# Altium project hv_io.PrjPCB
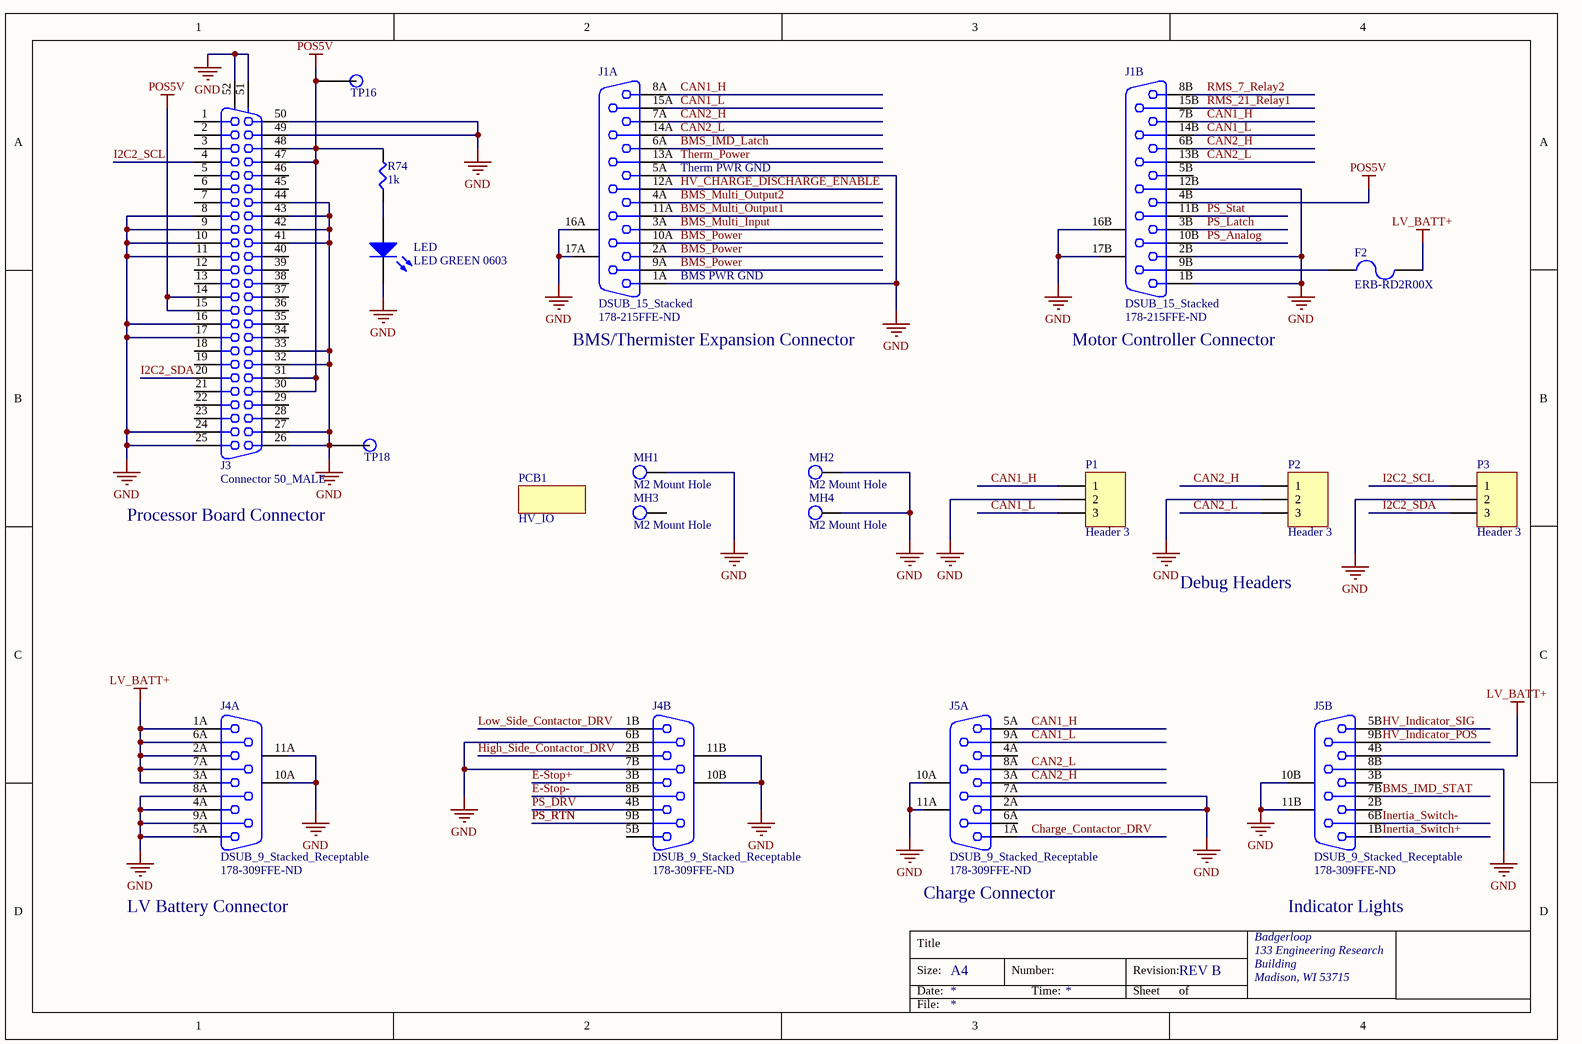
[diagram p0: hv_io_connector.SchDoc]
Revision: REV B; Part_Number: P4_EL_HV_002_HV_IO; Engineer: R. Castle; Designer: R. Castle
5 sheets, 154 parts. Net scope: global (net labels, ports and power ports of the same name join across sheets).
Board file: hv_io.PcbDoc
Sheets:
  hv_io_connector.SchDoc
  hv_io_bms.SchDoc
  hv_io_shutdown.SchDoc
  hv_io_DCDC.SchDoc
  hv_io_precharge.SchDoc

## Sheet hv_io_connector.SchDoc
size A4; Organization: Badgerloop; Address1: 133 Engineering Research; Address2: Building; Address3: Madison, WI 53715

### Parts
F2  ERB-RD2R00X  [SMD-0402-RES]
J1  DSUB_15_Stacked  Supplier Part Number 1: 178-215FFE-ND  [DSUB_15_Stacked]  (parts A,B of 2)
J3  Connector 50_MALE  [050DSUB1.27-H96 - Male]
J4  DSUB_9_Stacked_Receptable  Supplier Part Number 1: 178-309FFE-ND  [DSUB_9_Stacked]  (parts A,B of 2)
J5  DSUB_9_Stacked_Receptable  Supplier Part Number 1: 178-309FFE-ND  [DSUB_9_Stacked]  (parts A,B of 2)
LED  LED GREEN 0603  [LED 0603 GREEN]
MH1  M2 Mount Hole  [MH]
MH2  M2 Mount Hole  [MH]
MH3  M2 Mount Hole  [MH]
MH4  M2 Mount Hole  [MH]
P1  Header 3  [Pin Header 1x3 TH Pitch 2.54mm]
P2  Header 3  [Pin Header 1x3 TH Pitch 2.54mm]
P3  Header 3  [Pin Header 1x3 TH Pitch 2.54mm]
PCB1  HV_IO  [PCB]
R74  1k  [SMD-0805-RES]
TP16  TP  [Test Point]  (value not drawn)
TP18  TP  [Test Point]  (value not drawn)

### Nets
GND: J1.1A J1.1B J1.2B J1.5A J1.12B J1.16A(MH1) J1.16B(MH1) J1.17A(MH2) J1.17B(MH2) J3.8 J3.9 J3.10 J3.11 J3.16 J3.17 J3.24 J3.25 J3.26 J3.27 J3.32 J3.33 J3.41 J3.42 J3.43 J3.44 J3.49 J3.50 J3.51 J3.52 J4.4A J4.5A J4.6B J4.7B J4.8A J4.9A J4.10A(MH1) J4.10B(MH1) J4.11A(MH2) J4.11B(MH2) J5.2A J5.7A J5.8B J5.10A(MH1) J5.10B(MH1) J5.11A(MH2) J5.11B(MH2) LED.2(K) MH1.1 MH2.1 MH4.1 P1.2 P2.2 P3.2 TP18.1
LV_BATT+: F2.2 J4.1A J4.2A J4.3A J4.6A J4.7A J5.4B
POS5V: J1.4B J3.14 J3.15 J3.30 J3.31 J3.47 J3.48 R74.2 TP16.1
BMS_IMD_Latch: J1.6A
BMS_IMD_STAT: J5.7B
BMS_Multi_Input: J1.3A
BMS_Multi_Output1: J1.11A
BMS_Multi_Output2: J1.4A
BMS_Power: J1.2A J1.9A J1.10A
CAN1_H: J1.7B J1.8A J5.5A P1.1
CAN1_L: J1.14B J1.15A J5.9A P1.3
CAN2_H: J1.6B J1.7A J5.3A P2.1
CAN2_L: J1.13B J1.14A J5.8A P2.3
Charge_Contactor_DRV: J5.1A
E-Stop+: J4.3B
E-Stop-: J4.8B
High_Side_Contactor_DRV: J4.2B
HV_CHARGE_DISCHARGE_ENABLE: J1.12A
HV_Indicator_POS: J5.9B
HV_Indicator_SIG: J5.5B
I2C2_SCL: J3.4 P3.1
I2C2_SDA: J3.20 P3.3
Inertia_Switch+: J5.1B
Inertia_Switch-: J5.6B
Low_Side_Contactor_DRV: J4.1B
PS_Analog: J1.10B
PS_DRV: J4.4B
PS_Latch: J1.3B
PS_RTN: J4.9B
PS_Stat: J1.11B
RMS_7_Relay2: J1.8B
RMS_21_Relay1: J1.15B
Therm_Power: J1.13A
NetF2_1: F2.1 J1.9B
NetLED_1: LED.1(A) R74.1

Not connected (* = marked no-connect by the designer): J1 5B(5); J3 1 2 3 5 6 7 12 13 18 19 21 22 23 28 29 34 35 36 37 38 39 40 45 46; J4 5B(5); J5 2B(2) 3B(3) 4A(4) 6A(6); MH3 1

### Notes on the sheet
- (near J1) Therm PWR GND
- (near J1) BMS PWR GND
- (near J1) BMS/Thermister Expansion Connector
- (near J1) Motor Controller Connector
- Processor Board Connector
- Debug Headers
- LV Battery Connector
- (near J5) Charge Connector
- Indicator Lights
- Title
- Size:
- Date:
- A4
- Number:
- Time:
- Revision:
- Sheet
- of
- File:

### Library data of the parts
F2 = ERB-RD2R00X: FUSE BOARD MOUNT 2A 32VDC 0402; Manufacturer: Panasonic; Manufacturer P/N: ERB-RD2R00X; Digikey P/N: P15123TR-ND; Digikey Link: https://www.digikey.com/product-detail/en/panasonic-electronic-components/ERB-RD2R00X/P15123TR-ND/2796785
J1 = DSUB_15_Stacked: CONN D-SUB RCPT 15POS R/A SLDR; pin to pad: 1>16 1A>1 1B>16 2>17 2A>2 2B>17 3>18 3A>3 3B>18 4>19 4A>4 4B>19 5>20 5A>5 5B>20 6>21 6A>6 6B>21 7>22 7A>7 7B>22 8>23 8A>8 8B>23 9>24 9A>9 9B>24 10>25 10A>10 10B>25 11>26 11A>11 11B>26 12>27 12A>12 12B>27 13>28 13A>13 13B>28 14>29 14A>14 14B>29 15>30 15A>15 15B>30 16>31 16A>32 16B>34 17>32 17A>31 17B>33; Manufacturer: NorComp; Manufacturer Part Number: 178-015-513R491; Body Material: Steel; Current Rating: 5A; Connector Type: D-Sub,Receptacle,Signal; Number of Contacts: 30; Gender: Female; Supplier 1: Digi-Key; RoHS: Yes; Stock 1: 2348; Pricing 1: 1 = 8.81000, 10 = 8.42600, 35 = 7.66000, 70 = 7.27700, 105 = 7.08552, 280 = 6.31950, 525 = 5.93650, 1015 = 5.24710 (USD); Mount: Edge,Through Hole; Color: Black; Contact Plating: Gold; Contact Material: Brass; Housing Material: Nylon; Min Operating Temperature: -55°C; Max Operating Temperature: 105°C; Package Quantity: 35; Packaging: Tray; Termination: Solder; Features: Shielded; REACH SVHC: No SVHC; Lead Free: Lead Free; ComponentLink1URL: https://www.norcomp.net/rohspdfs/Connectors/17Y/178/513/178-YYY-513R491.pdf; ComponentLink1Description: https://www.norcomp.net/rohspdfs/Connectors/17Y/178/513/178-YYY-513R491.pdf; ComponentLink2URL: http://www.norcomp.net/rohspdfs/Connectors/17Y/178/513/178-YYY-513R491.pdf; ComponentLink2Description: http://www.norcomp.net/rohspdfs/Connectors/17Y/178/513/178-YYY-513R491.pdf
J3 = Connector 50_MALE: Receptacle Header Assemby; Manufacturer: HARTING; Manufacturer P/N: 09665526616; Digikey Link: https://www.digikey.com/product-detail/en/harting/09665526616/1195-2568-ND/3181151; Digikey P/N: 1195-2568-ND
J4 J5 = DSUB_9_Stacked_Receptable: CONN D-SUB RCPT 9POS R/A SLDR; pin to pad: 1>10 1A>1 1B>10 2>11 2A>2 2B>11 3>12 3A>3 3B>12 4>13 4A>4 4B>13 5>14 5A>5 5B>14 6>15 6A>6 6B>15 7>16 7A>7 7B>16 8>17 8A>8 8B>17 9>18 9A>9 9B>18 10>22 10A>20 10B>22 11>21 11A>19 11B>21; Manufacturer: NorComp; Manufacturer Part Number: 178-009-513R691; Plating: Nickel; Gender: Female to Female; Current Rating: 5A; Connector Type: D-Sub,Receptacle,Signal; Number of Contacts: 9; Number of Ports: 2; Supplier 1: Digi-Key; RoHS: Yes; Stock 1: 1545; Pricing 1: 1 = 7.32000, 10 = 7.01500, 45 = 6.40511, 90 = 6.10000, 135 = 5.79504, 270 = 5.18500, 540 = 4.88000, 1035 = 4.27000 (USD); Mount: Edge,Through Hole; Contact Material: Brass; Contact Plating: Gold; Color: Black; Shell Material: Steel; Housing Material: Nylon; Min Operating Temperature: -55°C; Max Operating Temperature: 105°C; Package Quantity: 45; Packaging: Tray; Termination: Solder; Features: Shielded; Lead Free: Lead Free; ComponentLink1URL: http://www.norcomp.net/rohspdfs/Connectors/17Y/178/513/178-YYY-513R691.pdf; ComponentLink1Description: http://www.norcomp.net/rohspdfs/Connectors/17Y/178/513/178-YYY-513R691.pdf
LED = LED GREEN 0603: Manufacturer: Lite-On Inc.; Manufacturer P/N: LTST-C190KGKT; Digikey P/N: 160-1435-1-ND; Package / Case: 0603; Color: GREEN
P1-P3 = Header 3: Header, 3-Pin; LatestRevisionDate: 17-Jul-2002; LatestRevisionNote: Re-released for DXP Platform.; Publisher: Altium Limited
PCB1 = PCB
R74 = ERJ-P06J102V: RES SMD 1K OHM 5% 1/2W 0805; Manufacturer: Panasonic Electronic Components; Factory Stock: 0; Unit Price (USD): 0.01839; @ qty: 1500; Minimum Quantity: 1; Power (Watts): 0.5W, 1/2W; Temperature Coefficient: ±200ppm/°C; Part Number: ERJ-P06J102V; Datasheets: https://industrial.panasonic.com/cdbs/www-data/pdf/RDA0000/AOA0000C243.pdf; Image: //media.digikey.com/Renders/Panasonic%20Renders/ERJ-0805%20Pkg.jpg; Digi-Key Part Number: P1.0KADCT-ND; Quantity Available: 124757; Packaging: Cut Tape (CT); Series: ERJ; Part Status: Active; Value: 1k; Tolerance: ±5%; Composition: Thick Film; Features: Automotive AEC-Q200, Pulse Withstanding; Operating Temperature: -55°C ~ 155°C; Package / Case: 0805 (2012 Metric); Supplier Device Package: 0805; Size / Dimension: 0.079" L x 0.049" W (2.00mm x 1.25mm); Height - Seated (Max): 0.028" (0.70mm); Number of Terminations: 2; Failure Rate: -; Digikey P/N: ERJ-P06J102V

## Sheet hv_io_bms.SchDoc
size A4; Organization: Badgerloop; Address1: 133 Engineering Research; Address2: Building; Address3: Madison, WI 53715
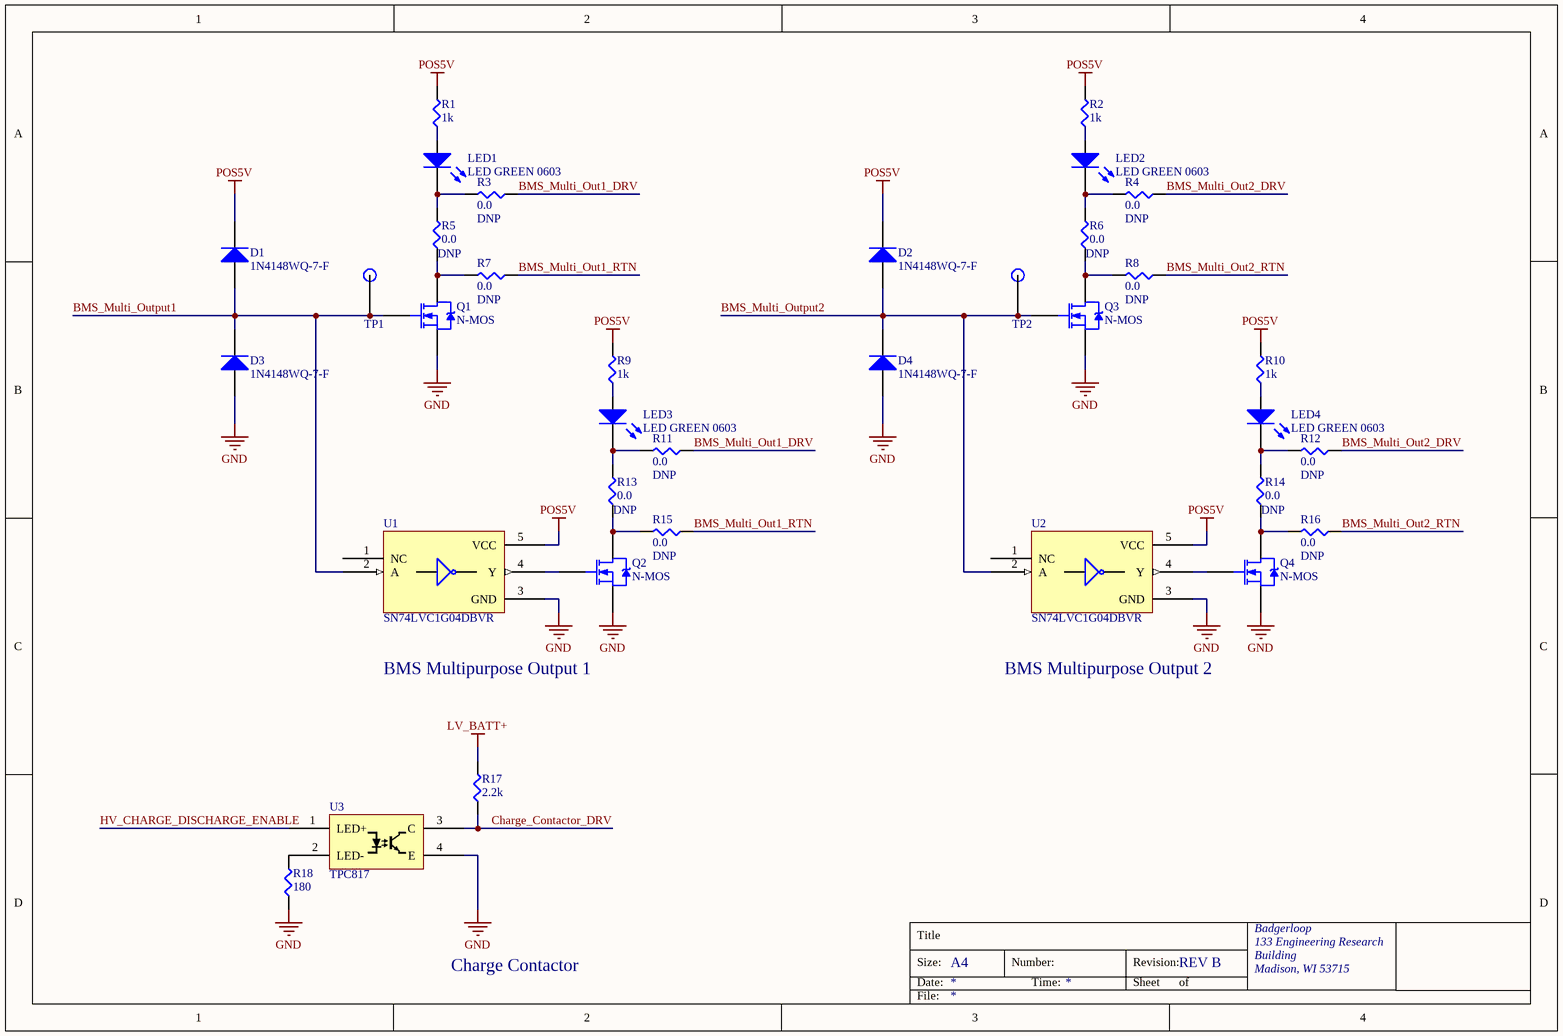
[diagram p1: hv_io_bms.SchDoc]

### Parts
D1  1N4148WQ-7-F  [SODFL370X100-2N]
D2  1N4148WQ-7-F  [SODFL370X100-2N]
D3  1N4148WQ-7-F  [SODFL370X100-2N]
D4  1N4148WQ-7-F  [SODFL370X100-2N]
LED1  LED GREEN 0603  [LED 0603 GREEN]
LED2  LED GREEN 0603  [LED 0603 GREEN]
LED3  LED GREEN 0603  [LED 0603 GREEN]
LED4  LED GREEN 0603  [LED 0603 GREEN]
Q1  N-MOS  [DPAK228P991X238-3N]
Q2  N-MOS  [DPAK228P991X238-3N]
Q3  N-MOS  [DPAK228P991X238-3N]
Q4  N-MOS  [DPAK228P991X238-3N]
R1  1k  [SMD-0402-RES]
R2  1k  [SMD-0402-RES]
R3  0.0  [SMD-0402-RES]
R4  0.0  [SMD-0402-RES]
R5  0.0  [SMD-0402-RES]
R6  0.0  [SMD-0402-RES]
R7  0.0  [SMD-0402-RES]
R8  0.0  [SMD-0402-RES]
R9  1k  [SMD-0402-RES]
R10  1k  [SMD-0402-RES]
R11  0.0  [SMD-0402-RES]
R12  0.0  [SMD-0402-RES]
R13  0.0  [SMD-0402-RES]
R14  0.0  [SMD-0402-RES]
R15  0.0  [SMD-0402-RES]
R16  0.0  [SMD-0402-RES]
R17  2.2k  [SMD-1206-RES]
R18  180  [SMD-1206-RES]
TP1  TP  [Test Point]  (value not drawn)
TP2  TP  [Test Point]  (value not drawn)
U1  SN74LVC1G04DBVR  [DBV5-L]
U2  SN74LVC1G04DBVR  [DBV5-L]
U3  TPC817  [SOT200P1005X328-5N]

### Nets
GND: D3.1(A) D4.1(A) Q1.3(S) Q2.3(S) Q3.3(S) Q4.3(S) R18.1 U1.3(GND) U2.3(GND) U3.4(E)
LV_BATT+: R17.2
POS5V: D1.2(K) D2.2(K) R1.2 R2.2 R9.2 R10.2 U1.5(VCC) U2.5(VCC)
BMS_Multi_Out1_DRV: R3.1 R11.1
BMS_Multi_Out1_RTN: R7.1 R15.1
BMS_Multi_Out2_DRV: R4.1 R12.1
BMS_Multi_Out2_RTN: R8.1 R16.1
BMS_Multi_Output1: D1.1(A) D3.2(K) Q1.1(G) TP1.1 U1.2(A)
BMS_Multi_Output2: D2.1(A) D4.2(K) Q3.1(G) TP2.1 U2.2(A)
Charge_Contactor_DRV: R17.1 U3.3(C)
HV_CHARGE_DISCHARGE_ENABLE: U3.1(LED+)
NetLED1_1: LED1.1(A) R1.1
NetLED1_2: LED1.2(K) R3.2 R5.2
NetLED2_1: LED2.1(A) R2.1
NetLED2_2: LED2.2(K) R4.2 R6.2
NetLED3_1: LED3.1(A) R9.1
NetLED3_2: LED3.2(K) R11.2 R13.2
NetLED4_1: LED4.1(A) R10.1
NetLED4_2: LED4.2(K) R12.2 R14.2
NetQ1_4: Q1.4(D) R5.1 R7.2
NetQ2_1: Q2.1(G) U1.4(Y)
NetQ2_4: Q2.4(D) R13.1 R15.2
NetQ3_4: Q3.4(D) R6.1 R8.2
NetQ4_1: Q4.1(G) U2.4(Y)
NetQ4_4: Q4.4(D) R14.1 R16.2
NetR18_2: R18.2 U3.2(LED-)

Not connected (* = marked no-connect by the designer): U1 1(NC); U2 1(NC)

### Notes on the sheet
- BMS Multipurpose Output 1
- BMS Multipurpose Output 2
- Charge Contactor
- Title
- Size:
- Date:
- A4
- Number:
- Time:
- Revision:
- Sheet
- of
- File:

### Library data of the parts
D1-D4 = 1N4148WQ-7-F: Diodes - General Purpose, Power, Switching SMT Fast Switching Diode; Manufacturer: Diodes Inc.; Digikey Link: https://www.digikey.com/product-detail/en/diodes-incorporated/1N4148WQ-7-F/1N4148WQ-7-FDITR-ND/8136126; Manufacturer P/N: 1N4148WQ-7-F; Digikey P/N: 1N4148WQ-7-FDITR-ND
LED1-LED4 = LED GREEN 0603: as LED on sheet hv_io_connector; Digikey P/N: 160-1435-1-ND; Package / Case: 0603; Color: GREEN
Q1-Q4 = N-MOS: N-Channel Power MOSFET, 12 A, 60 V; Manufacturer: ON SEMI; Manufacturer P/N: NTD3055L104T4G; Digikey Link: https://www.digikey.com/product-detail/en/on-semiconductor/NTD3055L104T4G/NTD3055L104T4GOSDKR-ND/1749196; Digikey P/N: NTD3055L104T4GOSDKR-ND
R1 R2 R9 R10 = ERJ-2GEJ102X: RES SMD 1K OHM 5% 1/10W 0402; Manufacturer: Panasonic Electronic Components; Factory Stock: 0; Unit Price (USD): 0.00350; @ qty: 1500; Minimum Quantity: 1; Power (Watts): 0.1W, 1/10W; Temperature Coefficient: ±200ppm/°C; Part Number: ERJ-2GEJ102X; Datasheets: http://industrial.panasonic.com/www-cgi/jvcr13pz.cgi?E+PZ+3+AOA0001+ERJ2GEJ102X+7+WW; Image: //media.digikey.com/Photos/Panasonic%20Photos/ERJ-PA2-Series.jpg; Digi-Key Part Number: P1.0KJCT-ND; Quantity Available: 1939857; Packaging: Cut Tape (CT); Series: ERJ; Part Status: Active; Value: 1k; Tolerance: ±5%; Composition: Thick Film; Features: Automotive AEC-Q200; Operating Temperature: -55°C ~ 155°C; Package / Case: 0402 (1005 Metric); Supplier Device Package: 0402; Size / Dimension: 0.039" L x 0.020" W (1.00mm x 0.50mm); Height - Seated (Max): 0.016" (0.40mm); Number of Terminations: 2; Failure Rate: -; Digikey P/N: ERJ-2GEJ102X
R3-R8 R11-R16 = ERJ-2GE0R00X: RES SMD 0.0OHM JUMPER 1/10W 0402; Manufacturer: Panasonic Electronic Components; Factory Stock: 0; Unit Price (USD): 0.00384; @ qty: 1500; Minimum Quantity: 1; Power (Watts): 0.1W, 1/10W; Part Number: ERJ-2GE0R00X; Datasheets: http://industrial.panasonic.com/www-cgi/jvcr13pz.cgi?E+PZ+3+AOA0001+ERJ2GE0R00X+7+WW; Image: //media.digikey.com/Photos/Panasonic%20Photos/ERJ-PA2-Series.jpg; Digi-Key Part Number: P0.0JCT-ND; Quantity Available: 3152483; Packaging: Cut Tape (CT); Series: ERJ; Part Status: Active; Value: 0.0; Tolerance: Jumper; Composition: Thick Film; Features: Automotive AEC-Q200; Temperature Coefficient: -; Operating Temperature: -55°C ~ 155°C; Package / Case: 0402 (1005 Metric); Supplier Device Package: 0402; Size / Dimension: 0.039" L x 0.020" W (1.00mm x 0.50mm); Height - Seated (Max): 0.016" (0.40mm); Number of Terminations: 2; Failure Rate: -; Digikey P/N: ERJ-2GE0R00X; DNP: DNP
R17 = ERJ-8ENF2201V: RES SMD 2.2K OHM 1% 1/4W 1206; Manufacturer: Panasonic Electronic Components; Factory Stock: 0; Unit Price (USD): 0.00933; @ qty: 1500; Minimum Quantity: 1; Power (Watts): 0.25W, 1/4W; Temperature Coefficient: ±100ppm/°C; Part Number: ERJ-8ENF2201V; Datasheets: http://industrial.panasonic.com/www-cgi/jvcr13pz.cgi?E+PZ+3+AOA0002+ERJ8ENF2201V+7+WW; Image: //media.digikey.com/Renders/Panasonic%20Renders/ERJ-1206%20Pkg.jpg; Digi-Key Part Number: P2.20KFCT-ND; Quantity Available: 220817; Packaging: Cut Tape (CT); Series: ERJ; Part Status: Active; Value: 2.2k; Tolerance: ±1%; Composition: Thick Film; Features: Automotive AEC-Q200; Operating Temperature: -55°C ~ 155°C; Package / Case: 1206 (3216 Metric); Supplier Device Package: 1206; Size / Dimension: 0.126" L x 0.063" W (3.20mm x 1.60mm); Height - Seated (Max): 0.028" (0.70mm); Number of Terminations: 2; Failure Rate: -; Digikey P/N: ERJ-8ENF2201V
R18 = ERJ-8ENF1800V: RES SMD 180 OHM 1% 1/4W 1206; Manufacturer: Panasonic Electronic Components; Factory Stock: 0; Unit Price (USD): 0.00933; @ qty: 1500; Minimum Quantity: 1; Power (Watts): 0.25W, 1/4W; Temperature Coefficient: ±100ppm/°C; Part Number: ERJ-8ENF1800V; Datasheets: http://industrial.panasonic.com/www-cgi/jvcr13pz.cgi?E+PZ+3+AOA0002+ERJ8ENF1800V+7+WW; Image: //media.digikey.com/Renders/Panasonic%20Renders/ERJ-1206%20Pkg.jpg; Digi-Key Part Number: P180FCT-ND; Quantity Available: 4031; Packaging: Cut Tape (CT); Series: ERJ; Part Status: Active; Value: 180; Tolerance: ±1%; Composition: Thick Film; Features: Automotive AEC-Q200; Operating Temperature: -55°C ~ 155°C; Package / Case: 1206 (3216 Metric); Supplier Device Package: 1206; Size / Dimension: 0.126" L x 0.063" W (3.20mm x 1.60mm); Height - Seated (Max): 0.028" (0.70mm); Number of Terminations: 2; Failure Rate: -
U1 U2 = SN74LVC1G04DBVR: Manufacturer: TI; Digikey Link: https://www.digikey.com/product-detail/en/texas-instruments/SN74LVC1G04DBVR/296-11599-1-ND/385738; Manufacturer P/N: SN74LVC1G04DBVR; Digikey P/N: 296-11599-1-ND
U3 = TPC817: OPTOISO 5KV TRANS 4SOP; Manufacturer: Taiwan Semi; Manufacturer P/N: TPC817S1B RAG; Digikey Link: https://www.digikey.com/product-detail/en/taiwan-semiconductor-corporation/TPC817S1B-RAG/TPC817S1BRAGCT-ND/7359679; Digikey P/N: TPC817S1BRAGCT-ND

## Sheet hv_io_shutdown.SchDoc
size A4; Organization: Badgerloop; Address1: 133 Engineering Research; Address2: Building; Address3: Madison, WI 53715
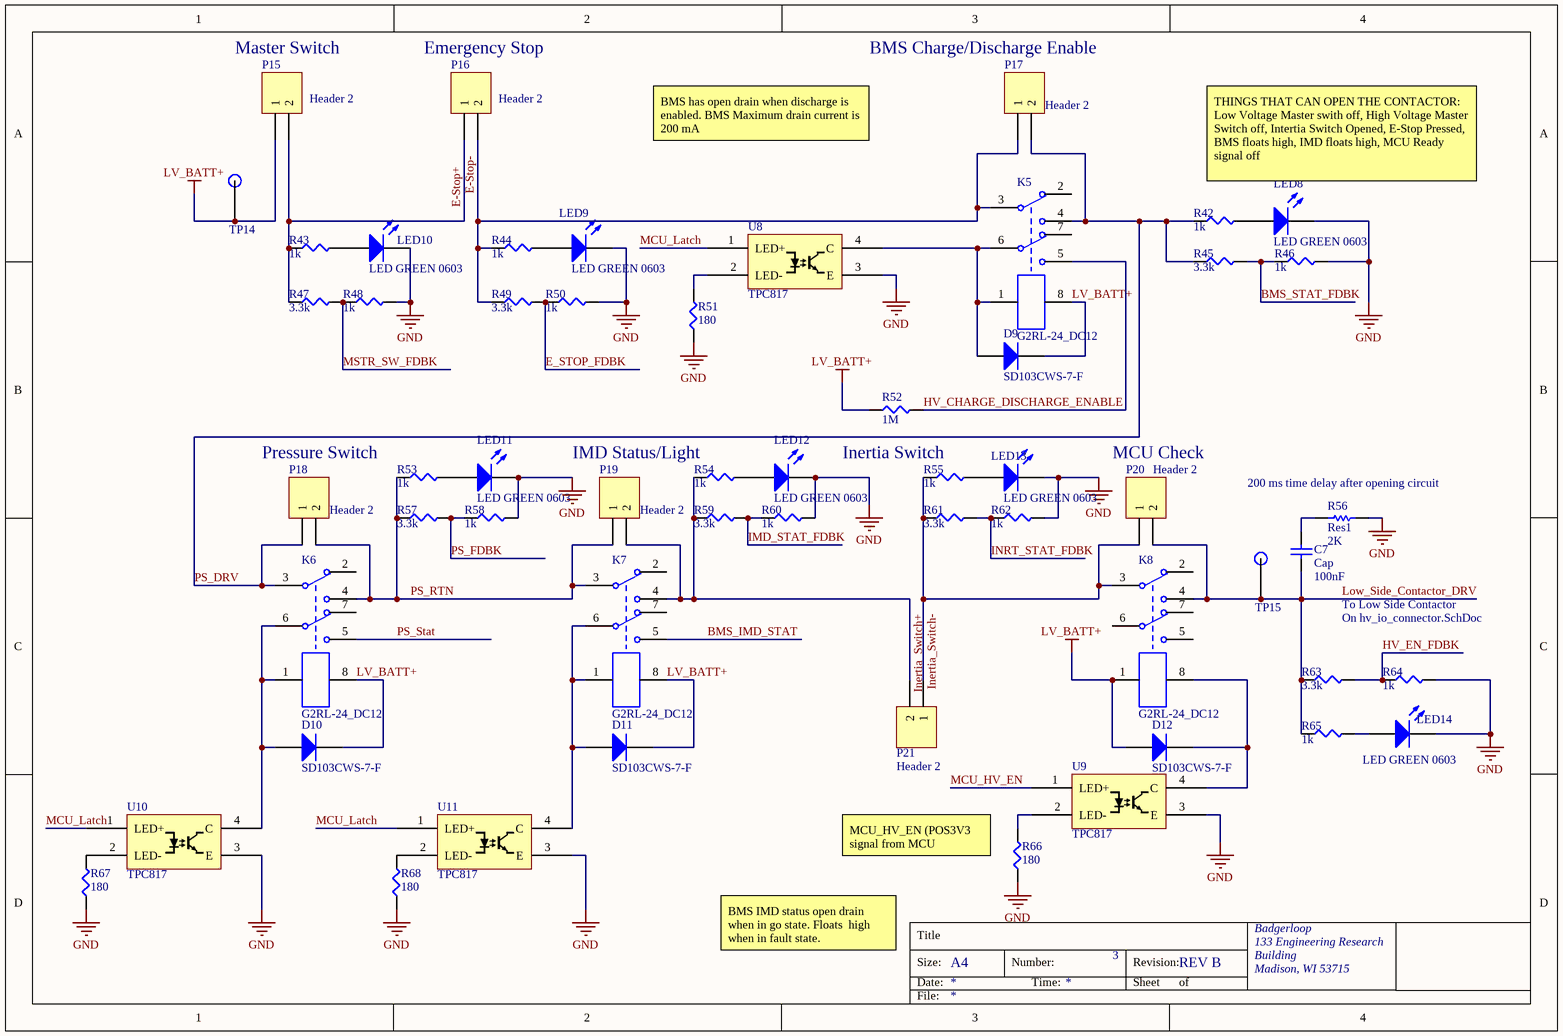
[diagram p2: hv_io_shutdown.SchDoc]

### Parts
C7  Cap  value 100nF  [SMD-1206C]
D9  SD103CWS-7-F  [SODFL250X110-2N]
D10  SD103CWS-7-F  [SODFL250X110-2N]
D11  SD103CWS-7-F  [SODFL250X110-2N]
D12  SD103CWS-7-F  [SODFL250X110-2N]
K5  G2RL-24_DC12  [G2RL]
K6  G2RL-24_DC12  [G2RL]
K7  G2RL-24_DC12  [G2RL]
K8  G2RL-24_DC12  [G2RL]
LED8  LED GREEN 0603  [LED 0603 GREEN]
LED9  LED GREEN 0603  [LED 0603 GREEN]
LED10  LED GREEN 0603  [LED 0603 GREEN]
LED11  LED GREEN 0603  [LED 0603 GREEN]
LED12  LED GREEN 0603  [LED 0603 GREEN]
LED13  LED GREEN 0603  [LED 0603 GREEN]
LED14  LED GREEN 0603  [LED 0603 GREEN]
P15  Header 2  [Pin Header 1x2 TH Pitch 2.54mm]
P16  Header 2  [Pin Header 1x2 TH Pitch 2.54mm]
P17  Header 2  [Pin Header 1x2 TH Pitch 2.54mm]
P18  Header 2  [Pin Header 1x2 TH Pitch 2.54mm]
P19  Header 2  [Pin Header 1x2 TH Pitch 2.54mm]
P20  Header 2  [Pin Header 1x2 TH Pitch 2.54mm]
P21  Header 2  [Pin Header 1x2 TH Pitch 2.54mm]
R42  1k  [SMD-0402-RES]
R43  1k  [SMD-0402-RES]
R44  1k  [SMD-0402-RES]
R45  3.3k  [SMD-0402-RES]
R46  1k  [SMD-0402-RES]
R47  3.3k  [SMD-0402-RES]
R48  1k  [SMD-0402-RES]
R49  3.3k  [SMD-0402-RES]
R50  1k  [SMD-0402-RES]
R51  180  [SMD-1206-RES]
R52  1M  [SMD-0805-RES]
R53  1k  [SMD-0402-RES]
R54  1k  [SMD-0402-RES]
R55  1k  [SMD-0402-RES]
R56  Res1  value 2K  [SMD-1206-RES]
R57  3.3k  [SMD-0402-RES]
R58  1k  [SMD-0402-RES]
R59  3.3k  [SMD-0402-RES]
R60  1k  [SMD-0402-RES]
R61  3.3k  [SMD-0402-RES]
R62  1k  [SMD-0402-RES]
R63  3.3k  [SMD-0402-RES]
R64  1k  [SMD-0402-RES]
R65  1k  [SMD-0402-RES]
R66  180  [SMD-1206-RES]
R67  180  [SMD-1206-RES]
R68  180  [SMD-1206-RES]
TP14  TP  [Test Point]  (value not drawn)
TP15  TP  [Test Point]  (value not drawn)
U8  TPC817  [SOT200P1005X328-5N]
U9  TPC817  [SOT200P1005X328-5N]
U10  TPC817  [SOT200P1005X328-5N]
U11  TPC817  [SOT200P1005X328-5N]

### Nets
GND: LED8.2(K) LED9.2(K) LED10.2(K) LED11.2(K) LED12.2(K) LED13.2(K) LED14.2(K) R46.2 R48.2 R50.2 R51.1 R56.2 R58.2 R60.2 R62.2 R64.2 R66.1 R67.1 R68.1 U8.3(E) U9.3(E) U10.3(E) U11.3(E)
LV_BATT+: D9.2(K) D10.2(K) D11.2(K) D12.1(A) K5.8 K6.8 K7.8 K8.1 P15.1 R52.1 TP14.1
BMS_IMD_STAT: K7.5
BMS_STAT_FDBK: R45.2 R46.1
E-Stop+: P15.2 P16.1 R43.1 R47.1
E-Stop-: K5.3 P16.2 P17.1 R44.1 R49.1
E_STOP_FDBK: R49.2 R50.1
HV_CHARGE_DISCHARGE_ENABLE: K5.5 R52.2
HV_EN_FDBK: R63.2 R64.1
IMD_STAT_FDBK: R59.2 R60.1
Inertia_Switch+: K7.4 P19.2 P21.2 R54.1 R59.1
Inertia_Switch-: K8.3 P20.1 P21.1 R55.1 R61.1
INRT_STAT_FDBK: R61.2 R62.1
Low_Side_Contactor_DRV: C7.1 K8.4 P20.2 R63.1 R65.1 TP15.1
MCU_HV_EN: U9.1(LED+)
MCU_Latch: U8.1(LED+) U10.1(LED+) U11.1(LED+)
MSTR_SW_FDBK: R47.2 R48.1
PS_DRV: K5.4 K6.3 P17.2 P18.1 R42.1 R45.1
PS_FDBK: R57.2 R58.1
PS_RTN: K6.4 K7.3 P18.2 P19.1 R53.1 R57.1
PS_Stat: K6.5
NetC7_2: C7.2 R56.1
NetD9_1: D9.1(A) K5.1 K5.6 U8.4(C)
NetD10_1: D10.1(A) K6.1 K6.6 U10.4(C)
NetD11_1: D11.1(A) K7.1 K7.6 U11.4(C)
NetD12_2: D12.2(K) K8.8 U9.4(C)
NetLED8_1: LED8.1(A) R42.2
NetLED9_1: LED9.1(A) R44.2
NetLED10_1: LED10.1(A) R43.2
NetLED11_1: LED11.1(A) R53.2
NetLED12_1: LED12.1(A) R54.2
NetLED13_1: LED13.1(A) R55.2
NetLED14_1: LED14.1(A) R65.2
NetR51_2: R51.2 U8.2(LED-)
NetR66_2: R66.2 U9.2(LED-)
NetR67_2: R67.2 U10.2(LED-)
NetR68_2: R68.2 U11.2(LED-)

Not connected (* = marked no-connect by the designer): K5 2 7; K6 2 7; K7 2 7; K8 2 5 6 7

### Notes on the sheet
- Master Switch
- Emergency Stop
- BMS Charge/Discharge Enable
- BMS has open drain when discharge is enabled. BMS Maximum drain current is 200 mA
- THINGS THAT CAN OPEN THE CONTACTOR: Low Voltage Master swith off, High Voltage Master Switch off, Intertia Switch Opened, E-Stop Pressed,  BMS floats high, IMD floats high, MCU Ready signal off
- (near R53) Pressure Switch
- (near R54) IMD Status/Light
- (near R55) Inertia Switch
- MCU Check
- (near R56) 200 ms time delay after opening circuit
- To Low Side Contactor
- On hv_io_connector.SchDoc
- (near R66) MCU_HV_EN (POS3V3 signal from MCU
- BMS IMD status open drain when in go state. Floats  high when in fault state.
- 3
- Title
- Size:
- Date:
- A4
- Number:
- Time:
- Revision:
- Sheet
- of
- File:

### Library data of the parts
C7 = Cap: Capacitor; Published: 8-Jun-2000; LatestRevisionDate: 17-Jul-2002; LatestRevisionNote: Re-released for DXP Platform.; PackageReference: RAD-0.3; Publisher: Altium Limited; PackageDescription: Radial Cap, Thru-Hole; 2 Leads; 0.3 in Pin Spacing
D9-D12 = Diode General Purpose_2: DIODE GEN PURP 20V 350MA SOD323; Manufacturer: Diodes Incorporated; Manufacturer P/N: SD103CWS-7-F; Digikey P/N: SD103CWS-FDIDKR-ND; Package / Case: SOD323; Do Not Populate: *; ComponentLink1Description: Digikey; ComponentLink1URL: https://www.digikey.com/product-detail/en/diodes-incorporated/SD103CWS-7-F/SD103CWS-FDIDKR-ND/1836772; ComponentLink2Description: Datasheet; ComponentLink2URL: https://www.diodes.com/assets/Datasheets/ds30101.pdf; ComponentLink3Description: Dimensions; ComponentLink3URL: https://www.diodes.com/assets/Package-Files/SOD323.pdf
K5-K8 = G2RL-24_DC12: RELAY GEN PURPOSE DPDT 8A 12V; Manufacturer: Omron Electronics; Manufacturer P/N: G2RL-24 DC12; Digikey Link: https://www.digikey.com/product-detail/en/omron-electronics-inc-emc-div/G2RL-24-DC12/Z147-ND/307667; Digikey P/N: Z147-ND
LED8-LED14 = LED GREEN 0603: as LED on sheet hv_io_connector; Digikey P/N: 160-1435-1-ND; Package / Case: 0603; Color: GREEN
P15-P21 = Header 2: Header, 2-Pin; LatestRevisionDate: 17-Jul-2002; LatestRevisionNote: Re-released for DXP Platform.; Publisher: Altium Limited
R42-R44 R46 R48 R50 R53-R55 R58 R60 R62 R64 R65 = ERJ-2GEJ102X: as R1 on sheet hv_io_bms; Part Number: ERJ-2GEJ102X; Datasheets: http://industrial.panasonic.com/www-cgi/jvcr13pz.cgi?E+PZ+3+AOA0001+ERJ2GEJ102X+7+WW; Image: //media.digikey.com/Photos/Panasonic%20Photos/ERJ-PA2-Series.jpg; Digi-Key Part Number: P1.0KJCT-ND; Quantity Available: 1939857; Packaging: Cut Tape (CT); Series: ERJ; Part Status: Active; Value: 1k; Tolerance: ±5%; Composition: Thick Film; Features: Automotive AEC-Q200; Operating Temperature: -55°C ~ 155°C; Package / Case: 0402 (1005 Metric); Supplier Device Package: 0402; Size / Dimension: 0.039" L x 0.020" W (1.00mm x 0.50mm); Height - Seated (Max): 0.016" (0.40mm); Number of Terminations: 2; Failure Rate: -; Digikey P/N: ERJ-2GEJ102X
R45 R47 R49 R57 R59 R61 R63 = ERJ-2GEJ332X: RES SMD 3.3K OHM 5% 1/10W 0402; Manufacturer: Panasonic Electronic Components; Factory Stock: 0; Unit Price (USD): 0.00350; @ qty: 1500; Minimum Quantity: 1; Power (Watts): 0.1W, 1/10W; Temperature Coefficient: ±200ppm/°C; Part Number: ERJ-2GEJ332X; Datasheets: http://industrial.panasonic.com/www-cgi/jvcr13pz.cgi?E+PZ+3+AOA0001+ERJ2GEJ332X+7+WW; Image: //media.digikey.com/Photos/Panasonic%20Photos/ERJ-PA2-Series.jpg; Digi-Key Part Number: P3.3KJCT-ND; Quantity Available: 514266; Packaging: Cut Tape (CT); Series: ERJ; Part Status: Active; Value: 3.3k; Tolerance: ±5%; Composition: Thick Film; Features: Automotive AEC-Q200; Operating Temperature: -55°C ~ 155°C; Package / Case: 0402 (1005 Metric); Supplier Device Package: 0402; Size / Dimension: 0.039" L x 0.020" W (1.00mm x 0.50mm); Height - Seated (Max): 0.016" (0.40mm); Number of Terminations: 2; Failure Rate: -; Digikey P/N: ERJ-2GEJ332X
R51 R66-R68 = ERJ-8ENF1800V: as R18 on sheet hv_io_bms; Part Number: ERJ-8ENF1800V; Datasheets: http://industrial.panasonic.com/www-cgi/jvcr13pz.cgi?E+PZ+3+AOA0002+ERJ8ENF1800V+7+WW; Image: //media.digikey.com/Renders/Panasonic%20Renders/ERJ-1206%20Pkg.jpg; Digi-Key Part Number: P180FCT-ND; Quantity Available: 4031; Packaging: Cut Tape (CT); Series: ERJ; Part Status: Active; Value: 180; Tolerance: ±1%; Composition: Thick Film; Features: Automotive AEC-Q200; Operating Temperature: -55°C ~ 155°C; Package / Case: 1206 (3216 Metric); Supplier Device Package: 1206; Size / Dimension: 0.126" L x 0.063" W (3.20mm x 1.60mm); Height - Seated (Max): 0.028" (0.70mm); Number of Terminations: 2; Failure Rate: -
R52 = ERJ-P06J105V: RES SMD 1M OHM 5% 1/2W 0805; Manufacturer: Panasonic Electronic Components; Factory Stock: 0; Unit Price (USD): 0.01839; @ qty: 1500; Minimum Quantity: 1; Power (Watts): 0.5W, 1/2W; Temperature Coefficient: ±200ppm/°C; Part Number: ERJ-P06J105V; Datasheets: https://industrial.panasonic.com/cdbs/www-data/pdf/RDA0000/AOA0000C243.pdf; Image: //media.digikey.com/Renders/Panasonic%20Renders/ERJ-0805%20Pkg.jpg; Digi-Key Part Number: P1.0MADCT-ND; Quantity Available: 36684; Packaging: Cut Tape (CT); Series: ERJ; Part Status: Active; Value: 1M; Tolerance: ±5%; Composition: Thick Film; Features: Automotive AEC-Q200, Pulse Withstanding; Operating Temperature: -55°C ~ 155°C; Package / Case: 0805 (2012 Metric); Supplier Device Package: 0805; Size / Dimension: 0.079" L x 0.049" W (2.00mm x 1.25mm); Height - Seated (Max): 0.028" (0.70mm); Number of Terminations: 2; Failure Rate: -; Digikey P/N: ERJ-P06J105V
R56 = Res1: Resistor; Published: 8-Jun-2000; LatestRevisionDate: 17-Jul-2002; LatestRevisionNote: Re-released for DXP Platform.; PackageReference: AXIAL-0.3; Publisher: Altium Limited; PackageDescription: Axial Device, Thru-Hole; 2 Leads; 0.3 in Pin Spacing
U8-U11 = TPC817: as U3 on sheet hv_io_bms; Digikey Link: https://www.digikey.com/product-detail/en/taiwan-semiconductor-corporation/TPC817S1B-RAG/TPC817S1BRAGCT-ND/7359679; Digikey P/N: TPC817S1BRAGCT-ND

## Sheet hv_io_DCDC.SchDoc
size A4; Organization: Badgerloop; Address1: 133 Engineering Research; Address2: Building; Address3: Madison, WI 53715
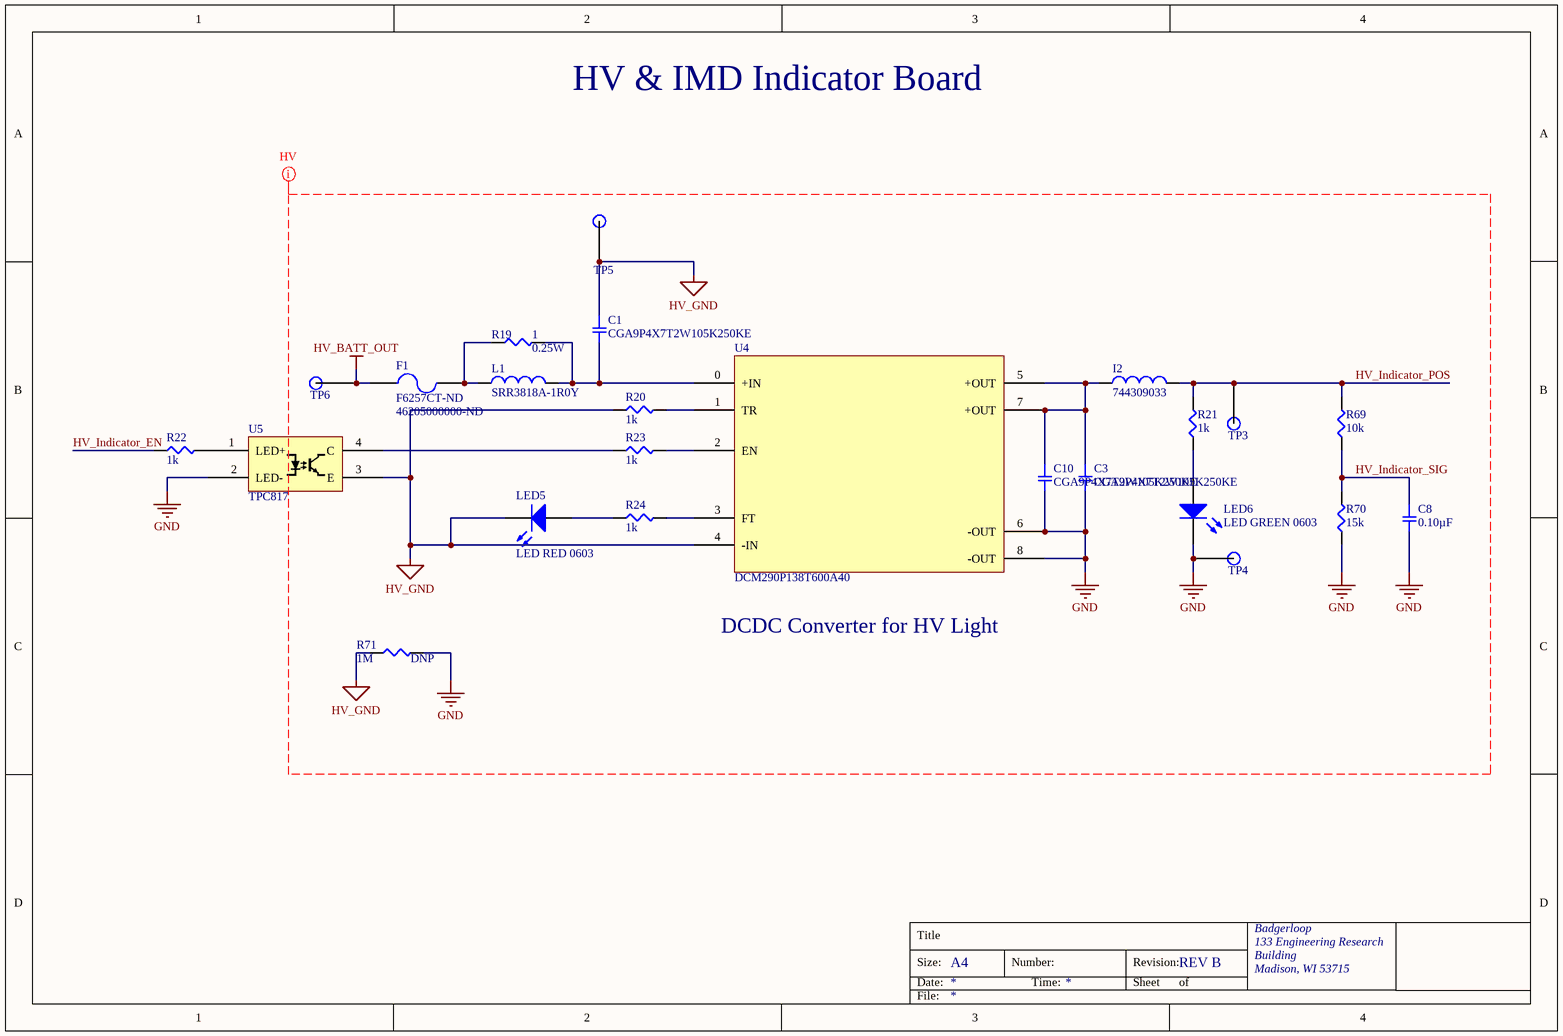
[diagram p3: hv_io_DCDC.SchDoc]

### Parts
C1  CGA9P4X7T2W105K250KE  [CAPC8350X15N]
C3  CGA9P4X7T2W105K250KE  [CAPC8350X15N]
C8  0.10µF  [SMD-0805C]
C10  CGA9P4X7T2W105K250KE  [CAPC8350X15N]
F1  F6257CT-ND  Supplier Part Number 1: 46205000000-ND  [F6257CT-ND]
I2  744309033  [INDM140130X90N]
L1  SRR3818A-1R0Y  [INDM3838X18N]
LED5  LED RED 0603  [LED 0603 RED]
LED6  LED GREEN 0603  [LED 0603 GREEN]
R19  1  Power (Watts): 0.25W  [SMD-1206-RES]
R20  1k  [SMD-0805-RES]
R21  1k  [SMD-0805-RES]
R22  1k  [SMD-0805-RES]
R23  1k  [SMD-0805-RES]
R24  1k  [SMD-0805-RES]
R69  10k  [SMD-0805-RES]
R70  15k  [SMD-0805-RES]
R71  1M  [SMD-1206-RES]
TP3  TP  [Test Point]  (value not drawn)
TP4  TP  [Test Point]  (value not drawn)
TP5  TP  [Test Point]  (value not drawn)
TP6  TP  [Test Point]  (value not drawn)
U4  DCM290P138T600A40  [DCM290y138x600A40]
U5  TPC817  [SOT200P1005X328-5N]

### Nets
GND: C3.2 C8.2 C10.2 LED6.2(K) R70.1 R71.2 TP4.1 U4.6(-OUT) U4.8(-OUT) U5.2(LED-)
HV_BATT_OUT: F1.1 TP6.1
HV_GND: C1.1 LED5.2(K) R20.1 R71.1 TP5.1 U4.4(-IN) U5.3(E)
HV_Indicator_EN: R22.1
HV_Indicator_POS: I2.2 R21.2 R69.2 TP3.1
HV_Indicator_SIG: C8.1 R69.1 R70.2
NetC1_2: C1.2 L1.2 R19.2 U4.0(+IN)
NetC3_1: C3.1 C10.1 I2.1 U4.5(+OUT) U4.7(+OUT)
NetF1_2: F1.2 L1.1 R19.1
NetLED5_1: LED5.1(A) R24.1
NetLED6_1: LED6.1(A) R21.1
NetR20_2: R20.2 U4.1(TR)
NetR22_2: R22.2 U5.1(LED+)
NetR23_1: R23.1 U5.4(C)
NetR23_2: R23.2 U4.2(EN)
NetR24_2: R24.2 U4.3(FT)

### Layout directives
rule Power Plane Clearance [Clearance = 30mil]: GND, HV_BATT_OUT, HV_GND, HV_Indicator_POS, HV_Indicator_SIG

### Notes on the sheet
- HV & IMD Indicator Board
- DCDC Converter for HV Light
- Title
- Size:
- Date:
- A4
- Number:
- Time:
- Revision:
- Sheet
- of
- File:

### Library data of the parts
C1 C3 C10 = CGA9P4X7T2W105K250KE: CAP CER 1UF 450V X7T 2220; Manufacturer: TDK; Digikey Link: https://www.digikey.com/product-detail/en/tdk-corporation/CGA9P4X7T2W105K250KE/445-8765-1-ND/3248632; Digikey P/N: 445-8765-1-ND; Manufacturer P/N: CGA9P4X7T2W105K250KE
C8 = GCD21BR71H104KA01L: CAP CER 0.1UF 50V X7R 0805; Manufacturer: Murata Electronics North America; Factory Stock: 0; Unit Price (USD): 0.24; Minimum Quantity: 1; Tolerance: ±10%; Datasheets: http://www.murata.com/~/media/webrenewal/support/library/catalog/products/capacitor/mlcc/c03e.ashx; Image: //media.digikey.com/Renders/Murata%20Renders/0805%28GxM6%29.jpg; Digikey P/N: 490-11955-1-ND; Part Number: GCD21BR71H104KA01L; Quantity Available: 157; @ qty: 0; Packaging: Cut Tape (CT); Series: GCD; Part Status: Active; Value: 0.10µF; Voltage: 50V; Temperature Coefficient: X7R; Operating Temperature: -55°C ~ 125°C; Features: -; Ratings: AEC-Q200; Applications: Automotive; Mounting Type: Surface Mount, MLCC; Package / Case: 0805 (2012 Metric); Size / Dimension: 0.079" L x 0.049" W (2.00mm x 1.25mm); Height - Seated (Max): -; Thickness (Max): 0.049" (1.25mm); Lead Spacing: -; Lead Style: -
F1 = F6257CT-ND: FUSE BOARD MNT 500MA 350VAC/VDC; Manufacturer: Littelfuse; Manufacturer P/N: 46205000000; Voltage Rating (AC): 350V; Voltage Rating (DC): 250V; DC Cold Resistance: 227mR; Power Dissipation: 200W; Fuse Type: Board Mount (Cartridge Style Excluded); Approvals: UL,UMF; Digikey P/N: F6257CT-ND; Digikey Link: https://www.digikey.com/product-detail/en/littelfuse-inc/46205000000/F6257CT-ND/4331764; Supplier 1: Digi-Key; Manufacturer Part Number: 46205000000; Stock 1: 0; Mount: Surface Mount; Case/Package: SMD/SMT; Housing Material: Plastic; Min Operating Temperature: -40°C; Max Operating Temperature: 85°C; Package Quantity: 1500; Packaging: Tape and Reel; Current Rating: 500mA; Length: 10.5mm; Height: 0.177inch; Width: 0.177inch; Depth: 4.5mm; Lead Free: Lead Free; ComponentLink1URL: http://www.littelfuse.com/~/media/electronics/datasheets/fuses/littelfuse_fuse_462_datasheet.pdf.pdf?src-supplier=Digi-Key; ComponentLink1Description: http://www.littelfuse.com/~/media/electronics/datasheets/fuses/littelfuse_fuse_462_datasheet.pdf.pdf?src-supplier=Digi-Key; ComponentLink2URL: http://www.mouser.com/ds/2/240/Littelfuse_Fuse_462-33205.pdf?src-supplier=Mouser; ComponentLink2Description: http://www.mouser.com/ds/2/240/Littelfuse_Fuse_462-33205.pdf?src-supplier=Mouser; ComponentLink3URL: http://www.littelfuse.com/data/en/Data_Sheets/Littelfuse_Fuse_462.pdf?src-supplier=Digi-Key; ComponentLink3Description: http://www.littelfuse.com/data/en/Data_Sheets/Littelfuse_Fuse_462.pdf?src-supplier=Digi-Key
I2 = 744309033: FIXED IND 330NH 47.5A 0.165 MOHM; Manufacturer: Wurth; Digikey Link: https://www.digikey.com/product-detail/en/wurth-electronics-inc/744309033/732-3006-1-ND/2626130; Digikey P/N: 732-3006-1-ND; Manufacturer P/N: 744309033
L1 = SRR3818A-1R0Y: FIXED IND 1UH 3.6A 37 MOHM SMD; Manufacturer: Bourns Inc.; Digikey Link: https://www.digikey.com/product-detail/en/bourns-inc/SRR3818A-1R0Y/SRR3818A-1R0YCT-ND/7556036; Digikey P/N: SRR3818A-1R0YCT-ND; Manufacturer P/N: SRR3818A-1R0Y
LED5 = LED RED 0603: Red 631nm LED Indication - Discrete 2V 0603 (1608 Metric); Manufacturer: Lite-On Inc.; Manufacturer P/N: LTST-C190KRKT; Digikey P/N: 160-1436-1-ND; Package / Case: 0603; Color: RED
LED6 = LED GREEN 0603: as LED on sheet hv_io_connector; Digikey P/N: 160-1435-1-ND; Package / Case: 0603; Color: GREEN
R19 = ERJ-8RQF1R0V: RES SMD 1 OHM 1% 1/4W 1206; Manufacturer: Panasonic Electronic Components; Factory Stock: 0; Unit Price (USD): 0.07650; @ qty: 1500; Temperature Coefficient: ±200ppm/°C; Part Number: ERJ-8RQF1R0V; Datasheets: https://industrial.panasonic.com/cdbs/www-data/pdf/RDA0000/AOA0000C239.pdf; Image: //media.digikey.com/Renders/Panasonic%20Renders/ERJ-1206%20Pkg.jpg; Digi-Key Part Number: P1.0RCT-ND; Quantity Available: 73166; Minimum Quantity: 1; Packaging: Cut Tape (CT); Series: ERJ; Part Status: Active; Value: 1; Tolerance: ±1%; Composition: Thick Film; Features: Automotive AEC-Q200, Current Sense; Operating Temperature: -55°C ~ 125°C; Package / Case: 1206 (3216 Metric); Supplier Device Package: 1206; Size / Dimension: 0.126" L x 0.063" W (3.20mm x 1.60mm); Height - Seated (Max): 0.028" (0.70mm); Number of Terminations: 2; Failure Rate: -; Digikey P/N: ERJ-8RQF1R0V
R20-R24 = ERJ-6ENF1001V: RES SMD 1K OHM 1% 1/8W 0805; Manufacturer: Panasonic Electronic Components; Factory Stock: 0; Unit Price (USD): 0.00729; @ qty: 1500; Minimum Quantity: 1; Power (Watts): 0.125W, 1/8W; Temperature Coefficient: ±100ppm/°C; Part Number: ERJ-6ENF1001V; Datasheets: http://industrial.panasonic.com/www-cgi/jvcr13pz.cgi?E+PZ+3+AOA0002+ERJ6ENF1001V+7+WW; Image: //media.digikey.com/Renders/Panasonic%20Renders/ERJ-0805%20Pkg.jpg; Digi-Key Part Number: P1.00KCCT-ND; Quantity Available: 12895103; Packaging: Cut Tape (CT); Series: ERJ; Part Status: Active; Value: 1k; Tolerance: ±1%; Composition: Thick Film; Features: Automotive AEC-Q200; Operating Temperature: -55°C ~ 155°C; Package / Case: 0805 (2012 Metric); Supplier Device Package: 0805; Size / Dimension: 0.079" L x 0.049" W (2.00mm x 1.25mm); Height - Seated (Max): 0.028" (0.70mm); Number of Terminations: 2; Failure Rate: -; Digikey P/N: ERJ-6ENF1001V
R69 = ERJ-P06J103V: RES SMD 10K OHM 5% 1/2W 0805; Manufacturer: Panasonic Electronic Components; Factory Stock: 0; Unit Price (USD): 0.01839; @ qty: 1500; Minimum Quantity: 1; Power (Watts): 0.5W, 1/2W; Temperature Coefficient: ±200ppm/°C; Part Number: ERJ-P06J103V; Datasheets: https://industrial.panasonic.com/cdbs/www-data/pdf/RDA0000/AOA0000C243.pdf; Image: //media.digikey.com/Renders/Panasonic%20Renders/ERJ-0805%20Pkg.jpg; Digi-Key Part Number: P10KADCT-ND; Quantity Available: 413576; Packaging: Cut Tape (CT); Series: ERJ; Part Status: Active; Value: 10k; Tolerance: ±5%; Composition: Thick Film; Features: Automotive AEC-Q200, Pulse Withstanding; Operating Temperature: -55°C ~ 155°C; Package / Case: 0805 (2012 Metric); Supplier Device Package: 0805; Size / Dimension: 0.079" L x 0.049" W (2.00mm x 1.25mm); Height - Seated (Max): 0.028" (0.70mm); Number of Terminations: 2; Failure Rate: -; Digikey P/N: ERJ-P06J103V
R70 = ERJ-P06J153V: RES SMD 15K OHM 5% 1/2W 0805; Manufacturer: Panasonic Electronic Components; Factory Stock: 0; Unit Price (USD): 0.01839; @ qty: 1500; Minimum Quantity: 1; Power (Watts): 0.5W, 1/2W; Temperature Coefficient: ±200ppm/°C; Part Number: ERJ-P06J153V; Datasheets: https://industrial.panasonic.com/cdbs/www-data/pdf/RDA0000/AOA0000C243.pdf; Image: //media.digikey.com/Renders/Panasonic%20Renders/ERJ-0805%20Pkg.jpg; Digi-Key Part Number: P15KADCT-ND; Quantity Available: 18476; Packaging: Cut Tape (CT); Series: ERJ; Part Status: Active; Value: 15k; Tolerance: ±5%; Composition: Thick Film; Features: Automotive AEC-Q200, Pulse Withstanding; Operating Temperature: -55°C ~ 155°C; Package / Case: 0805 (2012 Metric); Supplier Device Package: 0805; Size / Dimension: 0.079" L x 0.049" W (2.00mm x 1.25mm); Height - Seated (Max): 0.028" (0.70mm); Number of Terminations: 2; Failure Rate: -; Digikey P/N: ERJ-P06J153V
R71 = ERJ-P08J105V: RES SMD 1M OHM 5% 2/3W 1206; Manufacturer: Panasonic Electronic Components; Factory Stock: 0; Unit Price (USD): 0.02178; @ qty: 1500; Minimum Quantity: 1; Power (Watts): 0.667W, 2/3W; Temperature Coefficient: ±200ppm/°C; Part Number: ERJ-P08J105V; Datasheets: https://industrial.panasonic.com/cdbs/www-data/pdf/RDA0000/AOA0000C243.pdf; Image: //media.digikey.com/Renders/Panasonic%20Renders/ERJ-1206%20Pkg.jpg; Digi-Key Part Number: P1.0MALCT-ND; Quantity Available: 10388; Packaging: Cut Tape (CT); Series: ERJ; Part Status: Active; Value: 1M; Tolerance: ±5%; Composition: Thick Film; Features: Automotive AEC-Q200, Pulse Withstanding; Operating Temperature: -55°C ~ 155°C; Package / Case: 1206 (3216 Metric); Supplier Device Package: 1206; Size / Dimension: 0.126" L x 0.063" W (3.20mm x 1.60mm); Height - Seated (Max): 0.028" (0.70mm); Number of Terminations: 2; Failure Rate: -; Digikey P/N: ERJ-P08J105V; DNP: DNP
U4 = DCM290P138T600A40: DC DC CONVERTER 13.8V 600W; Manufacturer: Vicor; Manufacturer P/N: DCM290P138T600A40; Digikey Link: https://www.digikey.com/product-detail/en/vicor-corporation/DCM290P138T600A40/1102-5388-ND/4860626; Digikey P/N: 1102-5388-ND
U5 = TPC817: as U3 on sheet hv_io_bms; Digikey Link: https://www.digikey.com/product-detail/en/taiwan-semiconductor-corporation/TPC817S1B-RAG/TPC817S1BRAGCT-ND/7359679; Digikey P/N: TPC817S1BRAGCT-ND

## Sheet hv_io_precharge.SchDoc
size A4; Organization: Badgerloop; Address1: 133 Engineering Research; Address2: Building; Address3: Madison, WI 53715
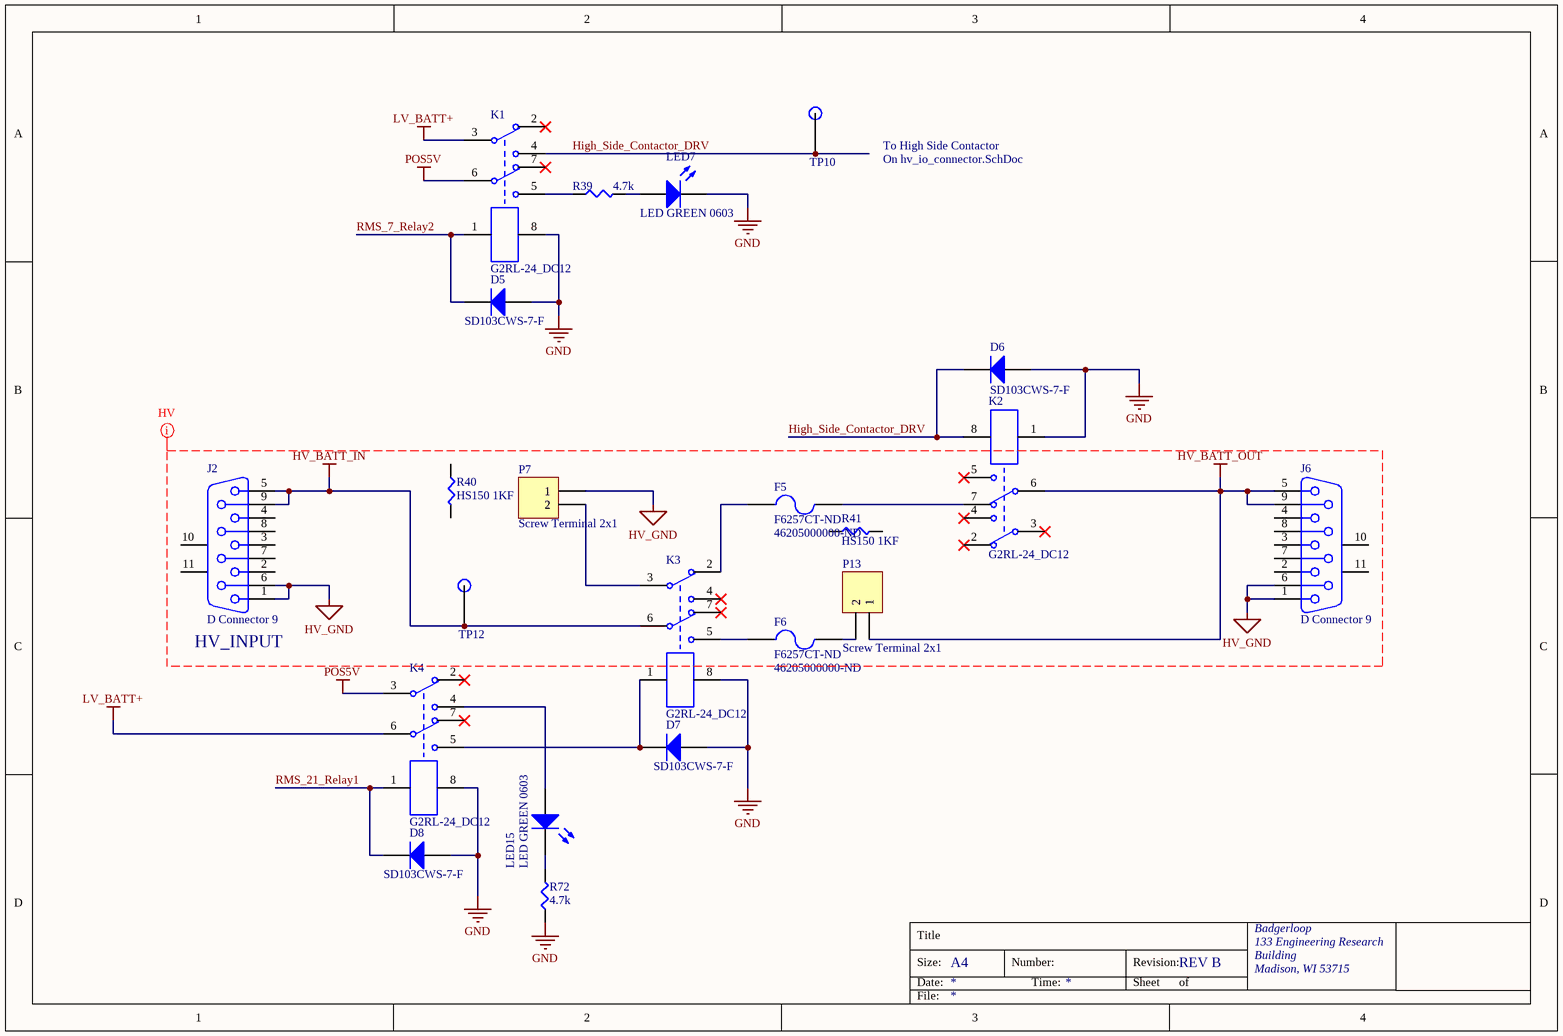
[diagram p4: hv_io_precharge.SchDoc]

### Parts
D5  SD103CWS-7-F  [SODFL250X110-2N]
D6  SD103CWS-7-F  [SODFL250X110-2N]
D7  SD103CWS-7-F  [SODFL250X110-2N]
D8  SD103CWS-7-F  [SODFL250X110-2N]
F5  F6257CT-ND  Supplier Part Number 1: 46205000000-ND  [F6257CT-ND]
F6  F6257CT-ND  Supplier Part Number 1: 46205000000-ND  [F6257CT-ND]
J2  D Connector 9  [DSUB1.385-2H9]
J6  D Connector 9  [DSUB1.385-2H9]
K1  G2RL-24_DC12  [G2RL]
K2  G2RL-24_DC12  [G2RL]
K3  G2RL-24_DC12  [G2RL]
K4  G2RL-24_DC12  [G2RL]
LED7  LED GREEN 0603  [LED 0603 GREEN]
LED15  LED GREEN 0603  [LED 0603 GREEN]
P7  Screw Terminal 2x1  [2POS TERM BLOCK]
P13  Screw Terminal 2x1  [2POS TERM BLOCK]
R39  4.7k  [SMD-0402-RES]
R40  HS150 1KF  [HS150 1KF]
R41  HS150 1KF  [HS150 1KF]
R72  4.7k  [SMD-0402-RES]
TP10  TP  [Test Point]  (value not drawn)
TP12  TP  [Test Point]  (value not drawn)

### Nets
GND: D5.1(A) D6.1(A) D7.1(A) D8.1(A) K1.8 K2.1 K3.8 K4.8 LED7.2(K) R72.1
HV_BATT_IN: J2.5 J2.9 K3.6 TP12.1
HV_BATT_OUT: J6.5 J6.9 K2.6 P13.1
HV_GND: J2.1 J2.6 J6.1 J6.6 P7.1
LV_BATT+: K1.3 K4.6
POS5V: K1.6 K4.3
High_Side_Contactor_DRV: D6.2(K) K1.4 K2.8 TP10.1
RMS_7_Relay2: D5.2(K) K1.1
RMS_21_Relay1: D8.2(K) K4.1
NetD7_2: D7.2(K) K3.1 K4.5
NetF5_1: F5.1 K3.2
NetF5_2: F5.2 K2.7
NetF6_1: F6.1 K3.5
NetF6_2: F6.2 P13.2
NetK1_5: K1.5 R39.1
NetK3_3: K3.3 P7.2
NetK4_4: K4.4 LED15.1(A)
NetLED7_1: LED7.1(A) R39.2
NetLED15_2: LED15.2(K) R72.2

Not connected (* = marked no-connect by the designer): J2 2 3 4 7 8 10(MH1) 11(MH2); J6 2 3 4 7 8 10(MH1) 11(MH2); K1 2* 7*; K2 2* 3* 4* 5*; K3 4* 7*; K4 2* 7*; R40 1 2; R41 1 2

### Layout directives
rule Power Plane Clearance [Clearance = 30mil]: HV_BATT_IN, HV_BATT_OUT, HV_GND

### Notes on the sheet
- To High Side Contactor
- On hv_io_connector.SchDoc
- (near J2) HV_INPUT
- Title
- Size:
- Date:
- A4
- Number:
- Time:
- Revision:
- Sheet
- of
- File:

### Library data of the parts
D5-D8 = Diode General Purpose_2: as D9 on sheet hv_io_shutdown; Manufacturer P/N: SD103CWS-7-F; Digikey P/N: SD103CWS-FDIDKR-ND; Package / Case: SOD323; Do Not Populate: *; ComponentLink1Description: Digikey; ComponentLink1URL: https://www.digikey.com/product-detail/en/diodes-incorporated/SD103CWS-7-F/SD103CWS-FDIDKR-ND/1836772; ComponentLink2Description: Datasheet; ComponentLink2URL: https://www.diodes.com/assets/Datasheets/ds30101.pdf; ComponentLink3Description: Dimensions; ComponentLink3URL: https://www.diodes.com/assets/Package-Files/SOD323.pdf
F5 F6 = F6257CT-ND: as F1 on sheet hv_io_DCDC; Digikey P/N: F6257CT-ND; Digikey Link: https://www.digikey.com/product-detail/en/littelfuse-inc/46205000000/F6257CT-ND/4331764; Supplier 1: Digi-Key; Manufacturer Part Number: 46205000000; Stock 1: 0; Mount: Surface Mount; Case/Package: SMD/SMT; Housing Material: Plastic; Min Operating Temperature: -40°C; Max Operating Temperature: 85°C; Package Quantity: 1500; Packaging: Tape and Reel; Current Rating: 500mA; Length: 10.5mm; Height: 0.177inch; Width: 0.177inch; Depth: 4.5mm; Lead Free: Lead Free; ComponentLink1URL: http://www.littelfuse.com/~/media/electronics/datasheets/fuses/littelfuse_fuse_462_datasheet.pdf.pdf?src-supplier=Digi-Key; ComponentLink1Description: http://www.littelfuse.com/~/media/electronics/datasheets/fuses/littelfuse_fuse_462_datasheet.pdf.pdf?src-supplier=Digi-Key; ComponentLink2URL: http://www.mouser.com/ds/2/240/Littelfuse_Fuse_462-33205.pdf?src-supplier=Mouser; ComponentLink2Description: http://www.mouser.com/ds/2/240/Littelfuse_Fuse_462-33205.pdf?src-supplier=Mouser; ComponentLink3URL: http://www.littelfuse.com/data/en/Data_Sheets/Littelfuse_Fuse_462.pdf?src-supplier=Digi-Key; ComponentLink3Description: http://www.littelfuse.com/data/en/Data_Sheets/Littelfuse_Fuse_462.pdf?src-supplier=Digi-Key
J2 J6 = D Connector 9: Receptacle Assembly, 9 Position, Right Angle; PackageDocument: O; Positions: 9; Published: 15-Jun-2001; LatestRevisionDate: 17-Jul-2002; LatestRevisionNote: Re-released for DXP Platform.; DatasheetDocument: 1-Sep-1999; PackageReference: 788750; Publisher: Altium Limited; Orientation: Right Angle; Gender: Receptacle
K1-K4 = G2RL-24_DC12: as K5 on sheet hv_io_shutdown; Digikey Link: https://www.digikey.com/product-detail/en/omron-electronics-inc-emc-div/G2RL-24-DC12/Z147-ND/307667; Digikey P/N: Z147-ND
LED7 LED15 = LED GREEN 0603: as LED on sheet hv_io_connector; Digikey P/N: 160-1435-1-ND; Package / Case: 0603; Color: GREEN
P7 P13 = Screw Terminal 2x1: Screw Terminal, 2-Pin
R39 R72 = ERJ-2GEJ472X: RES SMD 4.7K OHM 5% 1/10W 0402; Manufacturer: Panasonic Electronic Components; Factory Stock: 0; Unit Price (USD): 0.00350; @ qty: 1500; Minimum Quantity: 1; Power (Watts): 0.1W, 1/10W; Temperature Coefficient: ±200ppm/°C; Part Number: ERJ-2GEJ472X; Datasheets: http://industrial.panasonic.com/www-cgi/jvcr13pz.cgi?E+PZ+3+AOA0001+ERJ2GEJ472X+7+WW; Image: //media.digikey.com/Photos/Panasonic%20Photos/ERJ-PA2-Series.jpg; Digi-Key Part Number: P4.7KJCT-ND; Quantity Available: 8551774; Packaging: Cut Tape (CT); Series: ERJ; Part Status: Active; Value: 4.7k; Tolerance: ±5%; Composition: Thick Film; Features: Automotive AEC-Q200; Operating Temperature: -55°C ~ 155°C; Package / Case: 0402 (1005 Metric); Supplier Device Package: 0402; Size / Dimension: 0.039" L x 0.020" W (1.00mm x 0.50mm); Height - Seated (Max): 0.016" (0.40mm); Number of Terminations: 2; Failure Rate: -; Digikey P/N: ERJ-2GEJ472X
R40 R41 = HS150 1KF: 1K Power Resistor; Manufacturer: Ohmite; Digikey Link: https://www.digikey.com/product-detail/en/ohmite/HS150-1KF/HS1501KF-ND/5306251; Digikey P/N: HS1501KF-ND; Manufacturer P/N: HS150 1KF

## Nets that join several sheets
GND: hv_io_connector (54 pins), hv_io_bms (10 pins), hv_io_shutdown (23 pins), hv_io_DCDC (10 pins), hv_io_precharge (10 pins)
HV_BATT_OUT: hv_io_DCDC (F1.1 TP6.1), hv_io_precharge (J6.5 J6.9 K2.6 P13.1)
HV_GND: hv_io_DCDC (7 pins), hv_io_precharge (5 pins)
LV_BATT+: hv_io_connector (7 pins), hv_io_bms (R17.2), hv_io_shutdown (11 pins), hv_io_precharge (K1.3 K4.6)
POS5V: hv_io_connector (9 pins), hv_io_bms (8 pins), hv_io_precharge (K1.6 K4.3)
BMS_IMD_STAT: hv_io_connector (J5.7B), hv_io_shutdown (K7.5)
BMS_Multi_Output1: hv_io_connector (J1.11A), hv_io_bms (5 pins)
BMS_Multi_Output2: hv_io_connector (J1.4A), hv_io_bms (5 pins)
Charge_Contactor_DRV: hv_io_connector (J5.1A), hv_io_bms (R17.1 U3.3)
E-Stop+: hv_io_connector (J4.3B), hv_io_shutdown (P15.2 P16.1 R43.1 R47.1)
E-Stop-: hv_io_connector (J4.8B), hv_io_shutdown (5 pins)
High_Side_Contactor_DRV: hv_io_connector (J4.2B), hv_io_precharge (D6.2 K1.4 K2.8 TP10.1)
HV_CHARGE_DISCHARGE_ENABLE: hv_io_connector (J1.12A), hv_io_bms (U3.1), hv_io_shutdown (K5.5 R52.2)
HV_Indicator_POS: hv_io_connector (J5.9B), hv_io_DCDC (I2.2 R21.2 R69.2 TP3.1)
HV_Indicator_SIG: hv_io_connector (J5.5B), hv_io_DCDC (C8.1 R69.1 R70.2)
Inertia_Switch+: hv_io_connector (J5.1B), hv_io_shutdown (5 pins)
Inertia_Switch-: hv_io_connector (J5.6B), hv_io_shutdown (5 pins)
Low_Side_Contactor_DRV: hv_io_connector (J4.1B), hv_io_shutdown (6 pins)
PS_DRV: hv_io_connector (J4.4B), hv_io_shutdown (6 pins)
PS_RTN: hv_io_connector (J4.9B), hv_io_shutdown (6 pins)
PS_Stat: hv_io_connector (J1.11B), hv_io_shutdown (K6.5)
RMS_7_Relay2: hv_io_connector (J1.8B), hv_io_precharge (D5.2 K1.1)
RMS_21_Relay1: hv_io_connector (J1.15B), hv_io_precharge (D8.2 K4.1)